# Altium schematic sheet Wiring Diagram.SchDoc
size Letter; DocumentNumber: 9; SheetNumber: 9; SheetTotal: 11; Pagesize: Letter
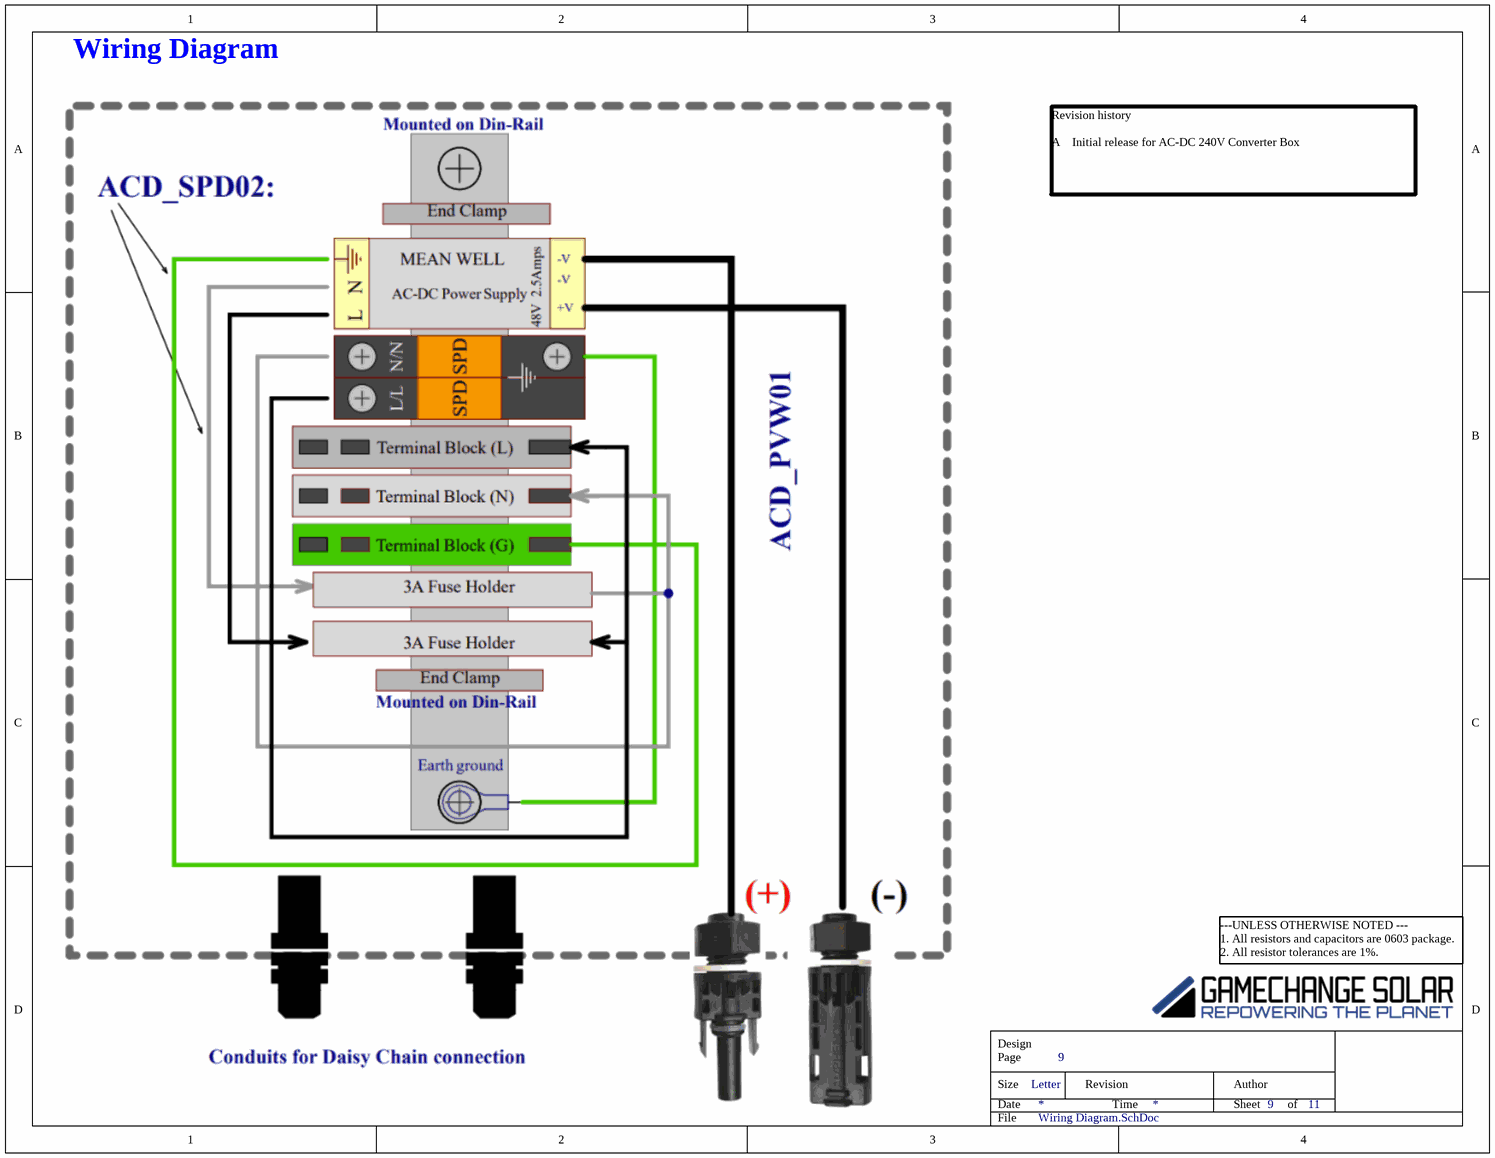
[diagram p0: Wiring Diagram.SchDoc]

## Notes on the sheet
- Wiring Diagram
- Revision history
  A    Initial release for AC-DC 240V Converter Box
- ---UNLESS OTHERWISE NOTED ---
  1. All resistors and capacitors are 0603 package.
  2. All resistor tolerances are 1%.
- Design
- Size
- Date
- Page
- Revision
- Time
- Sheet
- Author
- of
- File